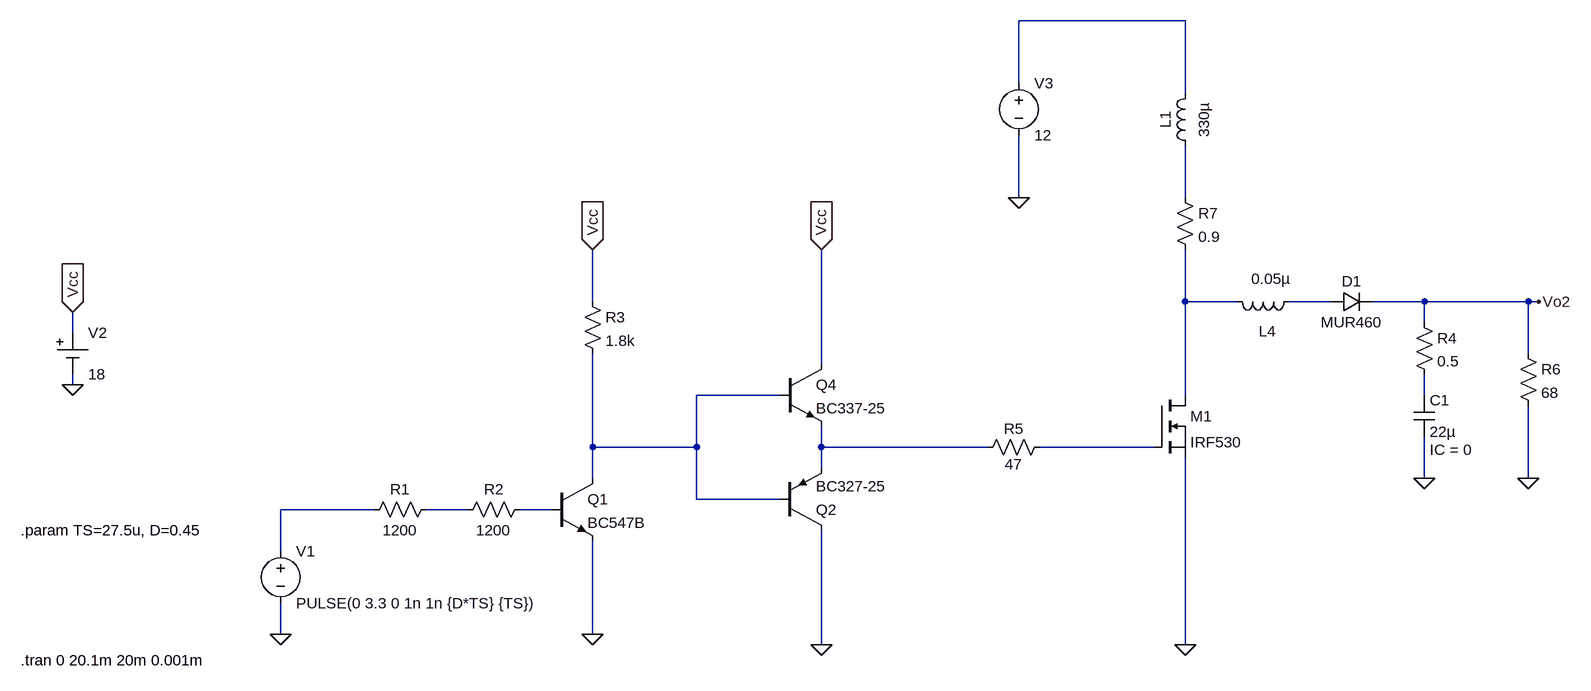
[diagram p0: schematic Boost_completa.asc]
Boost_completa.asc, the LTspice schematic file:
Version 4
SHEET 1 2296 680
WIRE 1424 -688 1168 -688
WIRE 1168 -592 1168 -688
WIRE 1424 -576 1424 -688
WIRE 1168 -416 1168 -512
WIRE 1424 -416 1424 -496
WIRE 512 -256 512 -336
WIRE 1424 -256 1424 -336
WIRE 1504 -256 1424 -256
WIRE 1648 -256 1584 -256
WIRE 1792 -256 1712 -256
WIRE 1952 -256 1792 -256
WIRE 1968 -256 1952 -256
WIRE 1792 -224 1792 -256
WIRE -288 -208 -288 -240
WIRE 1952 -176 1952 -256
WIRE 864 -160 864 -336
WIRE -288 -128 -288 -144
WIRE 800 -112 672 -112
WIRE 1424 -112 1424 -256
WIRE 1792 -112 1792 -144
WIRE 512 -32 512 -176
WIRE 672 -32 672 -112
WIRE 672 -32 512 -32
WIRE 864 -32 864 -64
WIRE 1120 -32 864 -32
WIRE 1376 -32 1200 -32
WIRE 864 0 864 -32
WIRE 512 16 512 -32
WIRE 1792 16 1792 -48
WIRE 1952 16 1952 -96
WIRE 672 48 672 -32
WIRE 800 48 672 48
WIRE 176 64 32 64
WIRE 320 64 256 64
WIRE 448 64 400 64
WIRE 32 128 32 64
WIRE 32 256 32 208
WIRE 512 256 512 112
WIRE 864 272 864 96
WIRE 1424 272 1424 -16
FLAG 32 256 0
FLAG 512 256 0
FLAG -288 -128 0
FLAG -288 -240 Vcc
IOPIN -288 -240 In
FLAG 512 -336 Vcc
IOPIN 512 -336 In
FLAG 864 272 0
FLAG 864 -336 Vcc
IOPIN 864 -336 In
FLAG 1792 16 0
FLAG 1968 -256 Vo2
FLAG 1952 16 0
FLAG 1424 272 0
FLAG 1168 -416 0
SYMBOL voltage 32 112 R0
WINDOW 123 0 0 Left 0
WINDOW 39 0 0 Left 0
SYMATTR InstName V1
SYMATTR Value PULSE(0 3.3 0 1n 1n {D*TS} {TS})
SYMBOL res 272 48 R90
WINDOW 0 0 56 VBottom 2
WINDOW 3 32 56 VTop 2
SYMATTR InstName R1
SYMATTR Value 1200
SYMBOL res 416 48 R90
WINDOW 0 0 56 VBottom 2
WINDOW 3 32 56 VTop 2
SYMATTR InstName R2
SYMATTR Value 1200
SYMBOL npn 448 16 R0
SYMATTR InstName Q1
SYMATTR Value BC547B
SYMBOL res 496 -272 R0
SYMATTR InstName R3
SYMATTR Value 1.8k
SYMBOL Misc\\cell -288 -208 R0
WINDOW 123 0 0 Left 0
WINDOW 39 0 0 Left 0
SYMATTR InstName V2
SYMATTR Value 18
SYMBOL npn 800 -160 R0
SYMATTR InstName Q4
SYMATTR Value BC337-25
SYMBOL pnp 800 96 M180
SYMATTR InstName Q2
SYMATTR Value BC327-25
SYMBOL ind 1440 -480 R180
WINDOW 3 3 56 VBottom 2
WINDOW 0 31 56 VTop 2
WINDOW 123 3 56 VTop 2
SYMATTR Value 330µ
SYMATTR InstName L1
SYMBOL cap 1776 -112 R0
WINDOW 123 24 84 Left 2
SYMATTR Value2 IC = 0
SYMATTR InstName C1
SYMATTR Value 22µ
SYMBOL diode 1648 -240 R270
WINDOW 0 32 32 VTop 2
WINDOW 3 0 32 VBottom 2
SYMATTR InstName D1
SYMATTR Value MUR460
SYMBOL nmos 1376 -112 R0
SYMATTR InstName M1
SYMATTR Value IRF530
SYMBOL res 1216 -48 R90
WINDOW 0 3 56 VBottom 2
WINDOW 3 27 56 VTop 2
SYMATTR InstName R5
SYMATTR Value 47
SYMBOL res 1936 -192 R0
SYMATTR InstName R6
SYMATTR Value 68
SYMBOL voltage 1168 -608 R0
WINDOW 123 0 0 Left 0
WINDOW 39 0 0 Left 0
SYMATTR InstName V3
SYMATTR Value 12
SYMBOL res 1776 -240 R0
SYMATTR InstName R4
SYMATTR Value 0.5
SYMBOL res 1408 -432 R0
SYMATTR InstName R7
SYMATTR Value 0.9
SYMBOL ind 1600 -272 R90
WINDOW 0 77 49 VBottom 2
WINDOW 3 -35 44 VTop 2
SYMATTR InstName L4
SYMATTR Value 0.05µ
TEXT -368 96 Left 2 !.param TS=27.5u, D=0.45
TEXT -368 296 Left 2 !.tran 0 20.1m 20m 0.001m

The netlist it stands for:
* Boost_completa.asc
V1 N009 0 PULSE(0 3.3 0 1n 1n {D*TS} {TS})
R1 N010 N009 1200
R2 N011 N010 1200
Q1 N005 N011 0 0 BC547B
R3 Vcc N005 1.8k
V2 Vcc 0 18
Q4 Vcc N005 N007 0 BC337-25
Q2 0 N005 N007 0 BC327-25
L1 N002 N001 330µ
C1 N006 0 22µ IC = 0
D1 N004 Vo2 MUR460
M1 N003 N008 0 0 IRF530
R5 N008 N007 47
R6 Vo2 0 68
V3 N001 0 12
R4 Vo2 N006 0.5
R7 N002 N003 0.9
L4 N004 N003 0.05µ
.model D D
.lib standard.dio
.model NPN NPN
.model PNP PNP
.lib standard.bjt
.model NMOS NMOS
.model PMOS PMOS
.lib standard.mos
.param TS=27.5u, D=0.45
.tran 0 20.1m 20m 0.001m
.backanno
.end